# Altium project ADC_LCD_PROJECT.PrjPcb
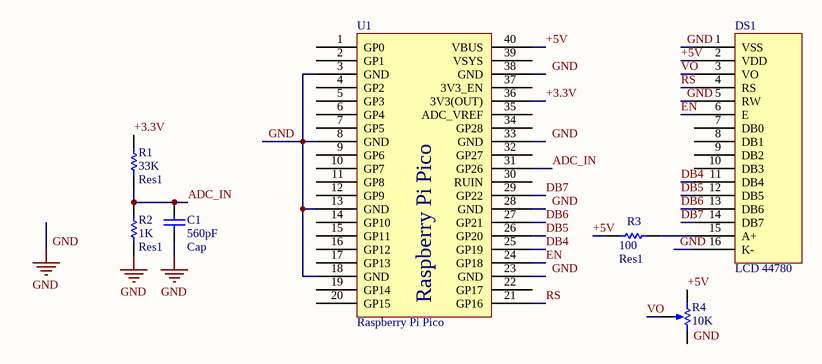
[diagram p0: ADC_LCD_PROJECT.SchDoc]
1 sheet, 7 parts. Net scope: global (net labels, ports and power ports of the same name join across sheets).

## Sheet ADC_LCD_PROJECT.SchDoc
size A; SheetNumber: 1; SheetTotal: 1

### Parts
C1  Cap  value 560pF  [RAD-0.3]
DS1  LCD 44780  [OLED 16x2]
R1  Res1  value 33K  [AXIAL-0.3]
R2  Res1  value 1K  [AXIAL-0.3]
R3  Res1  value 100  [AXIAL-0.3]
R4  value 10K  [POT inline wide]  (hidden comment: RPot_1)
U1  Raspberry Pi Pico  [Raspberry Pi Pico]

### Nets
  GND: C1.1 DS1.1(VSS) DS1.5(RW) DS1.16(K-) R2.1 R4.3(BOT) U1.3(GND) U1.8(GND) U1.13(GND) U1.18(GND) U1.23(GND) U1.28(GND) U1.33(GND) U1.38(GND)  [also labelled GND]
+3.3V: R1.2 U1.36(3V3(OUT))
+5V: DS1.2(VDD) R3.1 R4.1(TOP) U1.40(VBUS)
ADC_IN: C1.2 R1.1 R2.2 U1.31(GP26)
DB4: DS1.11(DB4) U1.25(GP19)
DB5: DS1.12(DB5) U1.26(GP20)
DB6: DS1.13(DB6) U1.27(GP21)
DB7: DS1.14(DB7) U1.29(GP22)
EN: DS1.6(E) U1.24(GP18)
RS: DS1.4(RS) U1.21(GP16)
VO: DS1.3(VO) R4.2(TAP)
NetDS1_15: DS1.15(A+) R3.2

Not connected (* = marked no-connect by the designer): DS1 7(DB0) 8(DB1) 9(DB2) 10(DB3); U1 1(GP0) 2(GP1) 4(GP2) 5(GP3) 6(GP4) 7(GP5) 9(GP6) 10(GP7) 11(GP8) 12(GP9) 14(GP10) 15(GP11) 16(GP12) 17(GP13) 19(GP14) 20(GP15) 22(GP17) 30(RUIN) 32(GP27) 34(GP28) 35(ADC_VREF) 37(3V3_EN) 39(VSYS)

### Library data of the parts
C1 = Cap: Capacitor; Published: 8-Jun-2000; LatestRevisionDate: 17-Jul-2002; LatestRevisionNote: Re-released for DXP Platform.; PackageReference: RAD-0.3; Publisher: Altium Limited; PackageDescription: Radial Cap, Thru-Hole; 2 Leads; 0.3 in Pin Spacing
R1-R3 = Res1: Resistor; Published: 8-Jun-2000; LatestRevisionDate: 17-Jul-2002; LatestRevisionNote: Re-released for DXP Platform.; PackageReference: AXIAL-0.3; Publisher: Altium Limited; PackageDescription: Axial Device, Thru-Hole; 2 Leads; 0.3 in Pin Spacing
R4 = RPot_3: Potentiometer; Sim Note: Enter the Resistance value and the set point into parameter fields.; Set Position: 0.5; Published: 8-Jun-2000; LatestRevisionDate: 17-Jul-2002; LatestRevisionNote: Re-released for DXP Platform.; PackageReference: VR5; Publisher: Altium Limited; PackageDescription: Variable Resistor, Thru-Hole; 3 Leads